# EasyEDA schematic SCH_voltage-multiplier_2026-06-30.json
TITLE: Sheet_1; REV: 1.0; Date: 2024-12-11; Sheet: 1/1; Drawn By: malekhmadi; Company: Your Company
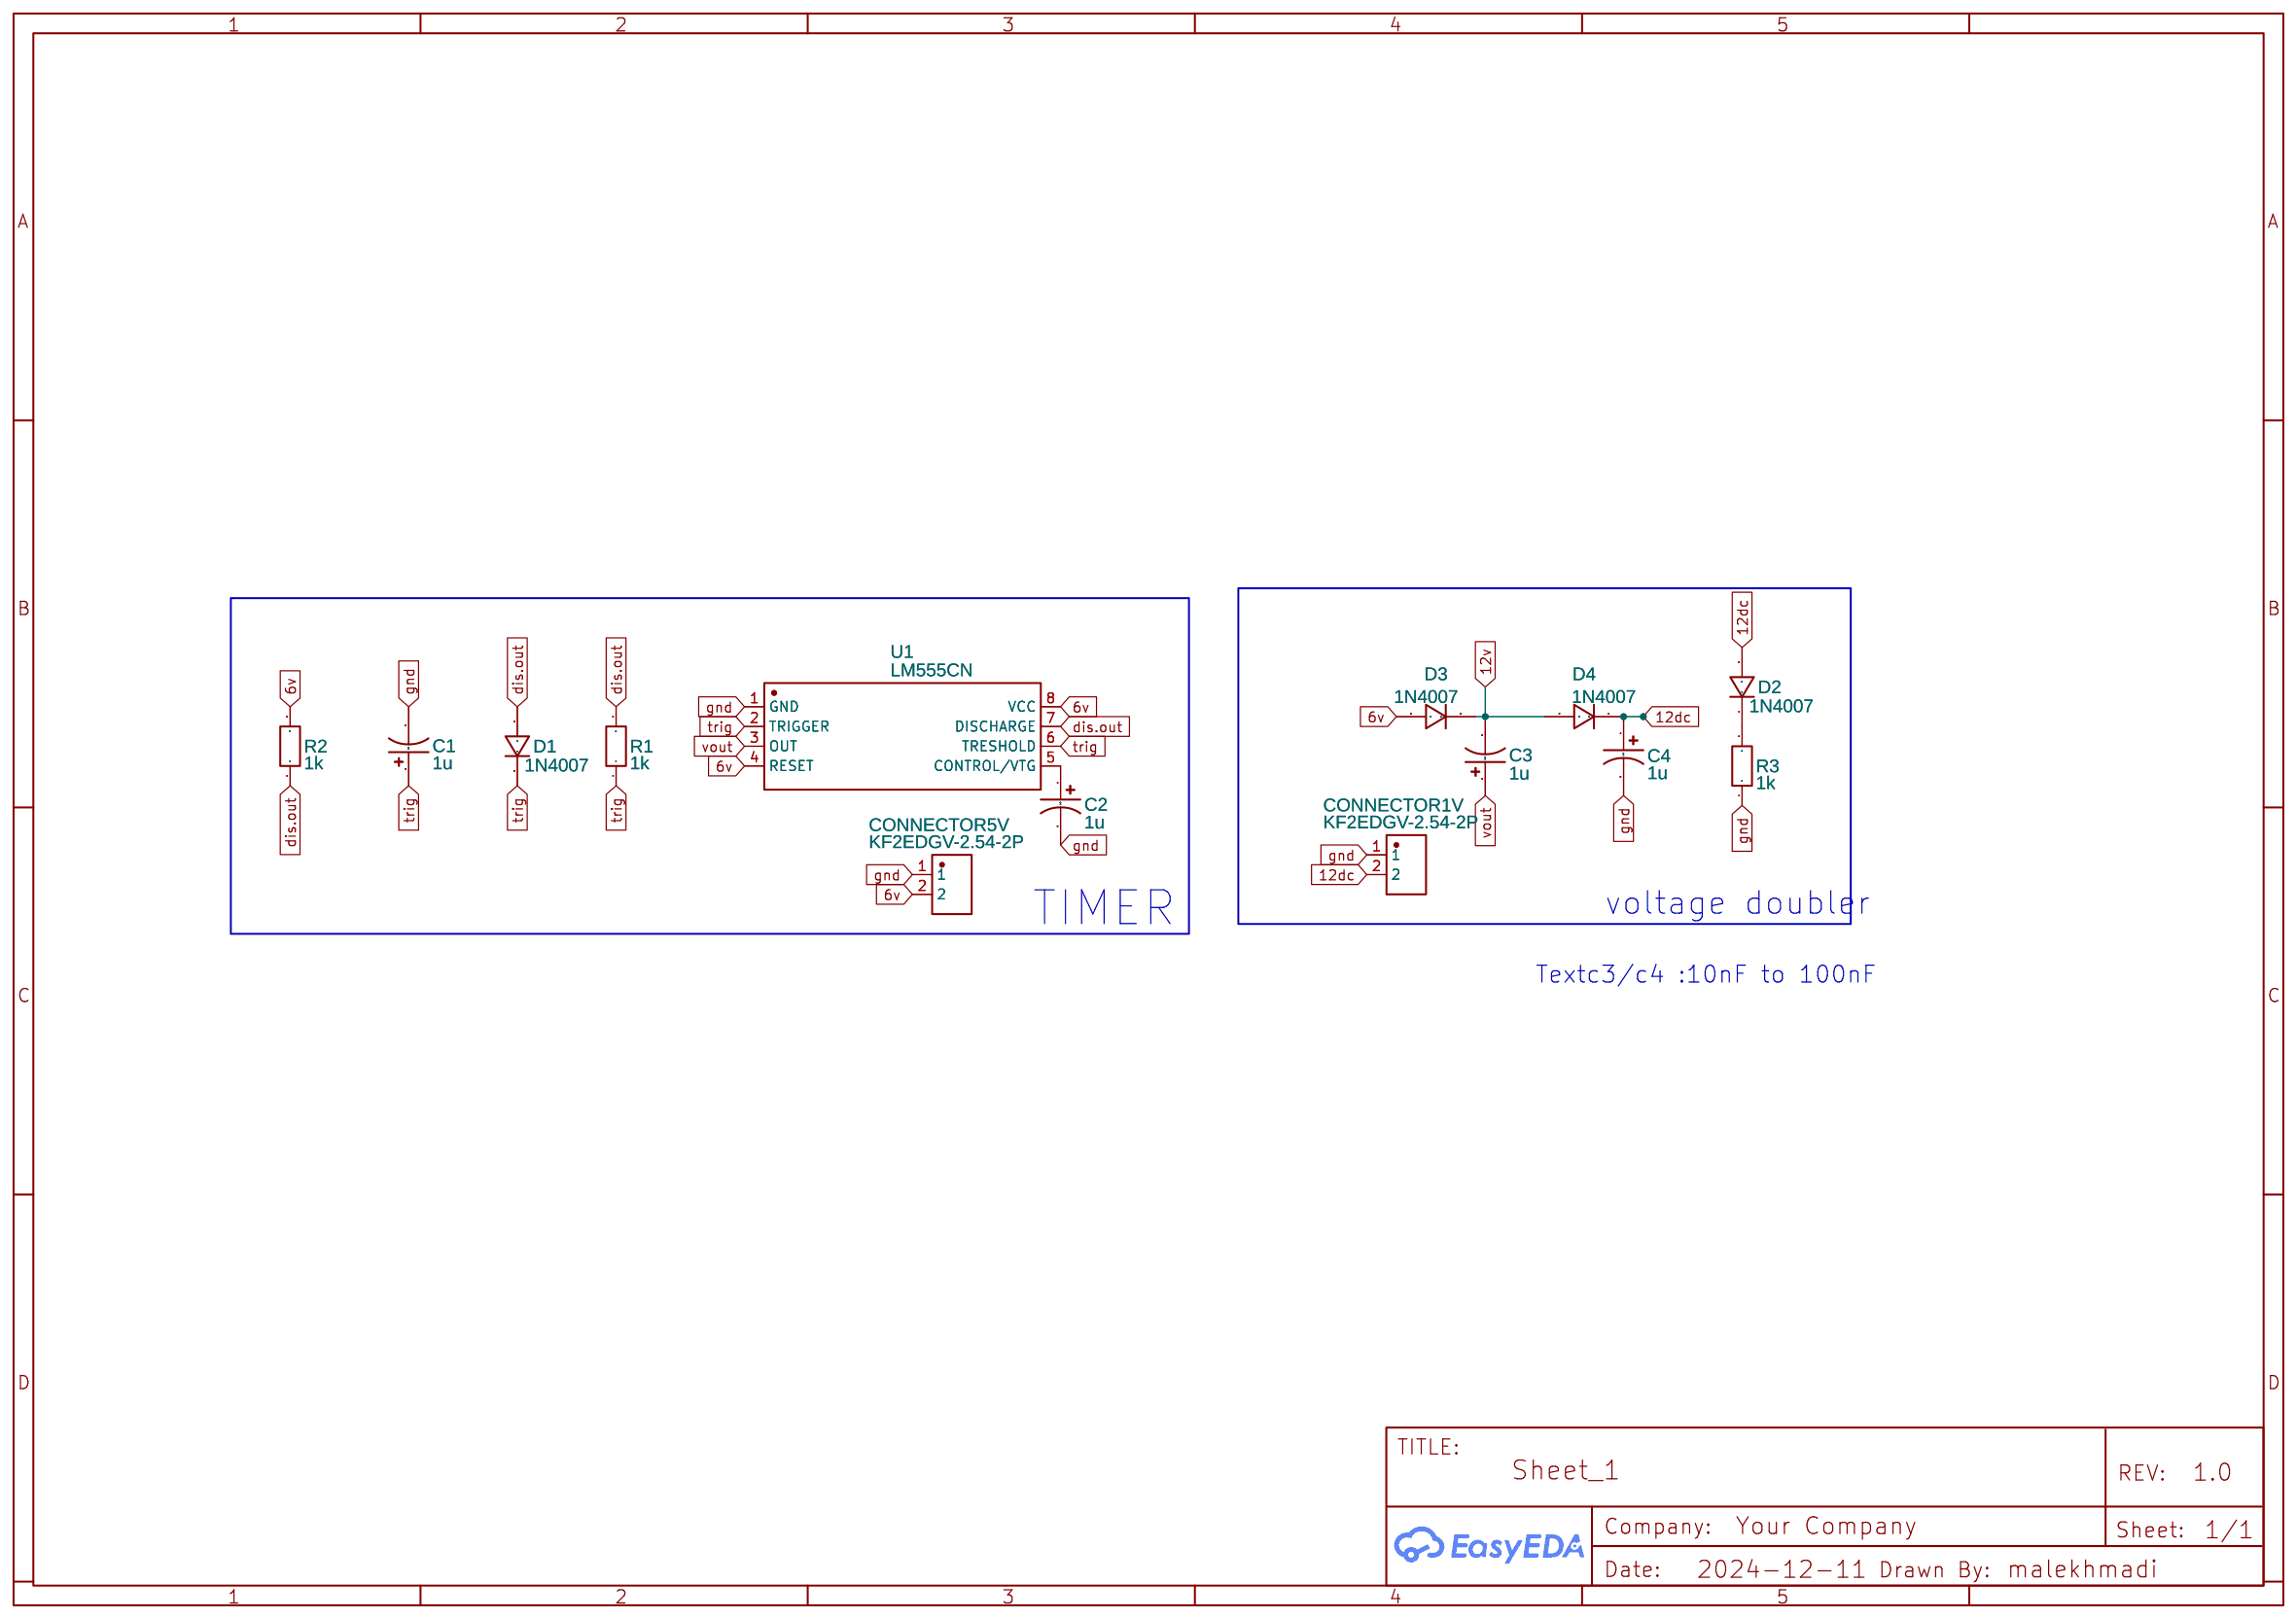
[diagram p0: schematic sheet]

## Parts
C1  1u  [CAP-D4.0×F1.5]
C2  1u  [CAP-D4.0×F1.5]
C3  1u  [CAP-D4.0×F1.5]
C4  1u  [CAP-D4.0×F1.5]
CONNECTOR1V  KF2EDGV-2.54-2P  [CONN-TH_KF2EDGV-2.54-2P]
CONNECTOR5V  KF2EDGV-2.54-2P  [CONN-TH_KF2EDGV-2.54-2P]
D1  1N4007  [DO-41_BD2.4-L4.7-P8.70-D0.9-RD]
D2  1N4007  [DO-41_BD2.4-L4.7-P8.70-D0.9-RD]
D3  1N4007  [DO-41_BD2.4-L4.7-P8.70-D0.9-RD]
D4  1N4007  [DO-41_BD2.4-L4.7-P8.70-D0.9-RD]
R1  1k  [R_AXIAL-0.3]
R2  1k  [R_AXIAL-0.3]
R3  1k  [R_AXIAL-0.3]
U1  LM555CN  [DIP-8_L9.7-W6.4-P2.54-LS7.6-BL]

## Library data of the parts
C1-C4 = CE_TH_D4.0×F1.5_US: Contributor: LCEDA_Lib
CONNECTOR1V CONNECTOR5V = KF2EDGV-2.54-2P: Contributor: LCSC; Supplier: LCSC; Supplier Part: C577535; Manufacturer: KEFA(科发); JLCPCB Part Class: Extended Part
D1-D4 = 1N4007: Supplier: LCSC; Manufacturer: SEMTECH; Supplier Part: C106903; Contributor: LCEDA_Lib
R1-R3 = R_AXIAL-0.3_EU: Contributor: LCEDA_Lib
U1 = LM555CN: Supplier: LCSC; Manufacturer: onsemi(安森美); Supplier Part: C110322; JLCPCB Part Class: Extended Part

## Nets
6v: CONNECTOR5V.2 D3.2 R2.2 U1.4(RESET) U1.8(VCC)
12v: C3.2 D3.1 D4.2
gnd: C1.2 C2.2 C4.2 CONNECTOR1V.1 CONNECTOR5V.1 R3.1 U1.1(GND)
12dc: C4.1 CONNECTOR1V.2 D2.2 D4.1
dis.out: D1.2 R1.2 R2.1 U1.7(DISCHARGE)
trig: C1.1 D1.1 R1.1 U1.2(TRIGGER) U1.6(TRESHOLD)
vout: C3.1 U1.3(OUT)
Net-(C2-1): C2.1 U1.5(CONTROL/VTG)
Net-(D2-1): D2.1 R3.2

## Notes on the sheet
- TIMER
- voltage doubler
- Textc3/c4 :10nF to 100nF
